# Altium schematic sheet PumpSystem - Copy.SchDoc
size A3; CompanyName: FEDEVEL; Organization: FEDEVEL; DocumentNumber: 3; Revision: V1I1; SheetNumber: 3; SheetTotal: 12; PageSetup: Record=PageOptions|CenterHorizontal=True|CenterVertical=True|PrintScale=1.07|XCorrection=1.00|YCorrection=1.00|PrintKind=1|BorderSize=5000000|LeftOffset=0|BottomOffset=0|Orientation=2|PaperLength=1000|PaperWidth=1000|Scale=100|PaperSource=7|PrintQuality=600|MediaType=1|DitherType=10|PaperKind=A3|PrintScaleMode=1; ProjectName: KDS C6A816x Module
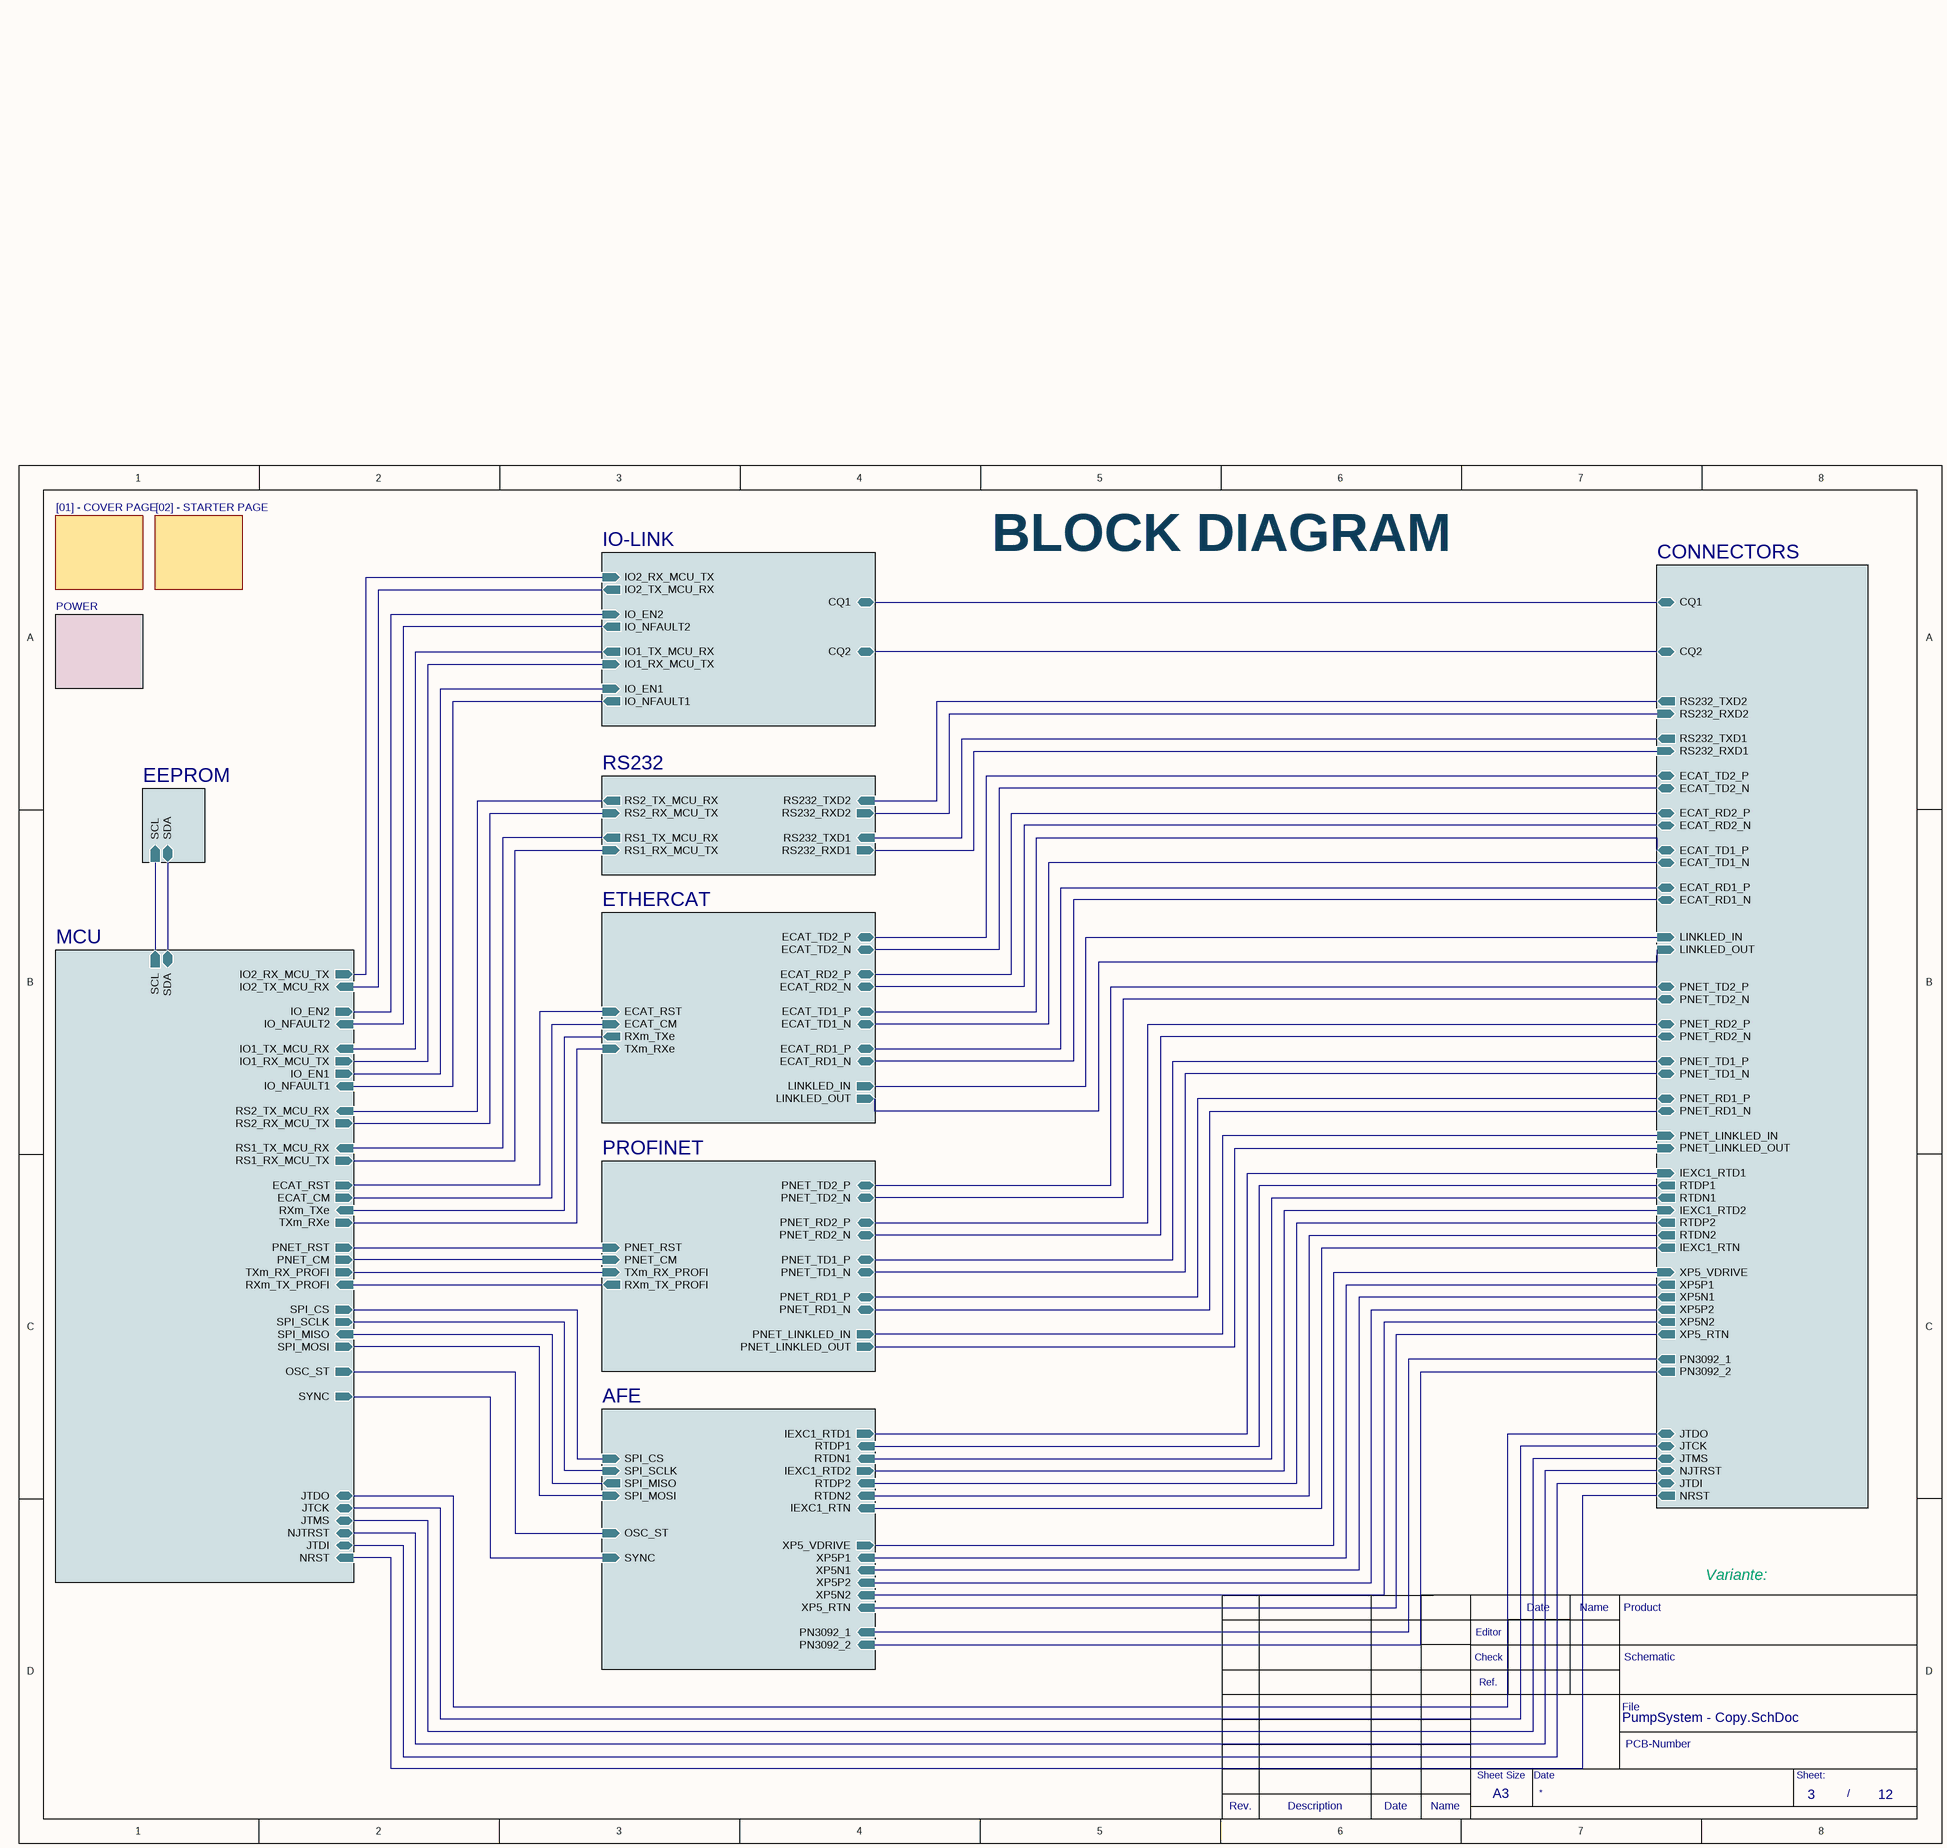
[diagram p0: PumpSystem - Copy.SchDoc]

## Sub-sheets
[01] - COVER PAGE = [01] - COVER PAGE.SchDoc: no entries
[02] - STARTER PAGE = [02] - STARTER PAGE.SchDoc: no entries
AFE = [09] - AFE.SchDoc: RTDN1 (in), IEXC1_RTD2 (out), XP5P1 (in), PN3092_1 (in), SPI_CS (in), SPI_MISO (out), XP5N1 (in), XP5P2 (in), XP5N2 (in), PN3092_2 (in), RTDP2 (in), XP5_RTN (in), RTDN2 (in), IEXC1_RTD1 (out), OSC_ST (in), IEXC1_RTN (in), SPI_MOSI (in), SPI_SCLK (in), XP5_VDRIVE (out), RTDP1 (in), SYNC (in)
CONNECTORS = [10] - CONNECTORs.SchDoc: ECAT_RD2_N (bidir), XP5_VDRIVE (in), ECAT_TD1_N (bidir), RTDP1 (out), CQ2 (bidir), RS232_RXD1 (in), ECAT_RD1_P (bidir), CQ1 (bidir), RS232_TXD1 (out), XP5_RTN (out), RS232_RXD2 (in), XP5N2 (out), IEXC1_RTD1 (in), XP5N1 (out), RTDN1 (out), ECAT_TD2_P (bidir), PNET_RD1_N (bidir), ECAT_RD2_P (bidir), XP5P1 (out), PNET_RD1_P (bidir), LINKLED_OUT (in), PNET_TD1_N (bidir), PNET_TD2_N (bidir), PNET_RD2_N (bidir), ECAT_TD1_P (bidir), RTDP2 (out), LINKLED_IN (in), PNET_TD1_P (bidir), ECAT_TD2_N (bidir), IEXC1_RTD2 (in), XP5P2 (out), ECAT_RD1_N (bidir), RTDN2 (out), RS232_TXD2 (out), PNET_RD2_P (bidir), IEXC1_RTN (out), JTMS (bidir), PNET_TD2_P (bidir), PNET_LINKLED_OUT (in), JTDO (bidir), JTDI (bidir), NJTRST (bidir), PN3092_2 (out), NRST (out), PN3092_1 (out), PNET_LINKLED_IN (in), JTCK (bidir)
EEPROM = [11] - EEPROM.SchDoc: SDA (bidir), SCL (in)
ETHERCAT = [04] - ETHERCAT.SchDoc: ECAT_RD2_P (bidir), TXm_RXe (in), ECAT_TD2_N (bidir), ECAT_CM (in), ECAT_RST (in), RXm_TXe (out), ECAT_TD1_P (bidir), LINKLED_IN (out), ECAT_RD1_N (bidir), ECAT_RD1_P (bidir), ECAT_TD2_P (bidir), ECAT_TD1_N (bidir), ECAT_RD2_N (bidir), LINKLED_OUT (out)
IO-LINK = [08] - IO-LINK.SchDoc: IO2_RX_MCU_TX (in), CQ1 (bidir), IO2_TX_MCU_RX (out), IO_NFAULT2 (out), CQ2 (bidir), IO_EN2 (in), IO_NFAULT1 (out), IO_EN1 (in), IO1_TX_MCU_RX (out), IO1_RX_MCU_TX (in)
MCU = [03] - MCU.SchDoc: RXm_TXe (in), IO2_RX_MCU_TX (out), TXm_RX_PROFI (out), NJTRST (bidir), SPI_MOSI (out), RXm_TX_PROFI (in), PNET_CM (out), RS1_RX_MCU_TX (out), OSC_ST (out), ECAT_RST (out), PNET_RST (out), JTMS (bidir), RS2_TX_MCU_RX (in), RS2_RX_MCU_TX (out), JTCK (bidir), NRST (in), IO_EN2 (out), SCL (out), IO2_TX_MCU_RX (in), IO_EN1 (out), TXm_RXe (out), SPI_SCLK (out), ECAT_CM (out), SPI_CS (out), JTDO (bidir), RS1_TX_MCU_RX (in), SDA (bidir), IO1_TX_MCU_RX (in), IO1_RX_MCU_TX (out), JTDI (bidir), SPI_MISO (in), IO_NFAULT1 (in), IO_NFAULT2 (in), SYNC (out)
POWER = [06] - POWER.SchDoc: no entries
PROFINET = [05] - PROFINET.SchDoc: PNET_RST (in), PNET_LINKLED_OUT (out), PNET_CM (in), TXm_RX_PROFI (in), PNET_TD2_P (bidir), PNET_TD2_N (bidir), RXm_TX_PROFI (out), PNET_LINKLED_IN (out), PNET_RD2_P (bidir), PNET_RD2_N (bidir), PNET_TD1_P (bidir), PNET_TD1_N (bidir), PNET_RD1_P (bidir), PNET_RD1_N (bidir)
RS232 = [07] - RS232.SchDoc: RS232_TXD1 (in), RS232_RXD1 (out), RS2_RX_MCU_TX (in), RS1_RX_MCU_TX (in), RS232_RXD2 (out), RS2_TX_MCU_RX (out), RS232_TXD2 (in), RS1_TX_MCU_RX (out)

## Nets
(unnamed): sheet MCU/RXm_TXe, sheet ETHERCAT/RXm_TXe
(unnamed): sheet MCU/IO2_RX_MCU_TX, sheet IO-LINK/IO2_RX_MCU_TX
(unnamed): sheet MCU/TXm_RX_PROFI, sheet PROFINET/TXm_RX_PROFI
(unnamed): sheet MCU/NJTRST, sheet CONNECTORS/NJTRST
(unnamed): sheet MCU/SPI_MOSI, sheet AFE/SPI_MOSI
(unnamed): sheet MCU/RXm_TX_PROFI, sheet PROFINET/RXm_TX_PROFI
(unnamed): sheet MCU/PNET_CM, sheet PROFINET/PNET_CM
(unnamed): sheet MCU/RS1_RX_MCU_TX, sheet RS232/RS1_RX_MCU_TX
(unnamed): sheet MCU/OSC_ST, sheet AFE/OSC_ST
(unnamed): sheet MCU/ECAT_RST, sheet ETHERCAT/ECAT_RST
(unnamed): sheet MCU/PNET_RST, sheet PROFINET/PNET_RST
(unnamed): sheet MCU/JTMS, sheet CONNECTORS/JTMS
(unnamed): sheet MCU/RS2_TX_MCU_RX, sheet RS232/RS2_TX_MCU_RX
(unnamed): sheet MCU/RS2_RX_MCU_TX, sheet RS232/RS2_RX_MCU_TX
(unnamed): sheet MCU/JTCK, sheet CONNECTORS/JTCK
(unnamed): sheet MCU/NRST, sheet CONNECTORS/NRST
(unnamed): sheet MCU/IO_EN2, sheet IO-LINK/IO_EN2
(unnamed): sheet MCU/SCL, sheet EEPROM/SCL
(unnamed): sheet MCU/IO2_TX_MCU_RX, sheet IO-LINK/IO2_TX_MCU_RX
(unnamed): sheet MCU/IO_EN1, sheet IO-LINK/IO_EN1
(unnamed): sheet MCU/TXm_RXe, sheet ETHERCAT/TXm_RXe
(unnamed): sheet MCU/SPI_SCLK, sheet AFE/SPI_SCLK
(unnamed): sheet MCU/ECAT_CM, sheet ETHERCAT/ECAT_CM
(unnamed): sheet MCU/SPI_CS, sheet AFE/SPI_CS
(unnamed): sheet MCU/JTDO, sheet CONNECTORS/JTDO
(unnamed): sheet MCU/RS1_TX_MCU_RX, sheet RS232/RS1_TX_MCU_RX
(unnamed): sheet MCU/SDA, sheet EEPROM/SDA
(unnamed): sheet MCU/IO1_TX_MCU_RX, sheet IO-LINK/IO1_TX_MCU_RX
(unnamed): sheet MCU/IO1_RX_MCU_TX, sheet IO-LINK/IO1_RX_MCU_TX
(unnamed): sheet MCU/JTDI, sheet CONNECTORS/JTDI
(unnamed): sheet MCU/SPI_MISO, sheet AFE/SPI_MISO
(unnamed): sheet MCU/IO_NFAULT1, sheet IO-LINK/IO_NFAULT1
(unnamed): sheet MCU/IO_NFAULT2, sheet IO-LINK/IO_NFAULT2
(unnamed): sheet MCU/SYNC, sheet AFE/SYNC
(unnamed): sheet ETHERCAT/ECAT_RD2_P, sheet CONNECTORS/ECAT_RD2_P
(unnamed): sheet ETHERCAT/ECAT_TD2_N, sheet CONNECTORS/ECAT_TD2_N
(unnamed): sheet ETHERCAT/ECAT_TD1_P, sheet CONNECTORS/ECAT_TD1_P
(unnamed): sheet ETHERCAT/LINKLED_IN, sheet CONNECTORS/LINKLED_IN
(unnamed): sheet ETHERCAT/ECAT_RD1_N, sheet CONNECTORS/ECAT_RD1_N
(unnamed): sheet ETHERCAT/ECAT_RD1_P, sheet CONNECTORS/ECAT_RD1_P
(unnamed): sheet ETHERCAT/ECAT_TD2_P, sheet CONNECTORS/ECAT_TD2_P
(unnamed): sheet ETHERCAT/ECAT_TD1_N, sheet CONNECTORS/ECAT_TD1_N
(unnamed): sheet ETHERCAT/ECAT_RD2_N, sheet CONNECTORS/ECAT_RD2_N
(unnamed): sheet ETHERCAT/LINKLED_OUT, sheet CONNECTORS/LINKLED_OUT
(unnamed): sheet PROFINET/PNET_LINKLED_OUT, sheet CONNECTORS/PNET_LINKLED_OUT
(unnamed): sheet PROFINET/PNET_TD2_P, sheet CONNECTORS/PNET_TD2_P
(unnamed): sheet PROFINET/PNET_TD2_N, sheet CONNECTORS/PNET_TD2_N
(unnamed): sheet PROFINET/PNET_LINKLED_IN, sheet CONNECTORS/PNET_LINKLED_IN
(unnamed): sheet PROFINET/PNET_RD2_P, sheet CONNECTORS/PNET_RD2_P
(unnamed): sheet PROFINET/PNET_RD2_N, sheet CONNECTORS/PNET_RD2_N
(unnamed): sheet PROFINET/PNET_TD1_P, sheet CONNECTORS/PNET_TD1_P
(unnamed): sheet PROFINET/PNET_TD1_N, sheet CONNECTORS/PNET_TD1_N
(unnamed): sheet PROFINET/PNET_RD1_P, sheet CONNECTORS/PNET_RD1_P
(unnamed): sheet PROFINET/PNET_RD1_N, sheet CONNECTORS/PNET_RD1_N
(unnamed): sheet RS232/RS232_TXD1, sheet CONNECTORS/RS232_TXD1
(unnamed): sheet RS232/RS232_RXD1, sheet CONNECTORS/RS232_RXD1
(unnamed): sheet RS232/RS232_RXD2, sheet CONNECTORS/RS232_RXD2
(unnamed): sheet RS232/RS232_TXD2, sheet CONNECTORS/RS232_TXD2
(unnamed): sheet IO-LINK/CQ1, sheet CONNECTORS/CQ1
(unnamed): sheet IO-LINK/CQ2, sheet CONNECTORS/CQ2
(unnamed): sheet AFE/RTDN1, sheet CONNECTORS/RTDN1
(unnamed): sheet AFE/IEXC1_RTD2, sheet CONNECTORS/IEXC1_RTD2
(unnamed): sheet AFE/XP5P1, sheet CONNECTORS/XP5P1
(unnamed): sheet AFE/PN3092_1, sheet CONNECTORS/PN3092_1
(unnamed): sheet AFE/XP5N1, sheet CONNECTORS/XP5N1
(unnamed): sheet AFE/XP5P2, sheet CONNECTORS/XP5P2
(unnamed): sheet AFE/XP5N2, sheet CONNECTORS/XP5N2
(unnamed): sheet AFE/PN3092_2, sheet CONNECTORS/PN3092_2
(unnamed): sheet AFE/RTDP2, sheet CONNECTORS/RTDP2
(unnamed): sheet AFE/XP5_RTN, sheet CONNECTORS/XP5_RTN
(unnamed): sheet AFE/RTDN2, sheet CONNECTORS/RTDN2
(unnamed): sheet AFE/IEXC1_RTD1, sheet CONNECTORS/IEXC1_RTD1
(unnamed): sheet AFE/IEXC1_RTN, sheet CONNECTORS/IEXC1_RTN
(unnamed): sheet AFE/XP5_VDRIVE, sheet CONNECTORS/XP5_VDRIVE
(unnamed): sheet AFE/RTDP1, sheet CONNECTORS/RTDP1

## Notes on the sheet
- BLOCK DIAGRAM
- Date
- Name
- Product
- Variante:
- Editor
- Check
- Ref.
- Schematic
- File
- PCB-Number
- Rev.
- Description
- Sheet Size
- A3
- Sheet:
- /